# Altium schematic sheet USB_MassProg.SchDoc
size A1
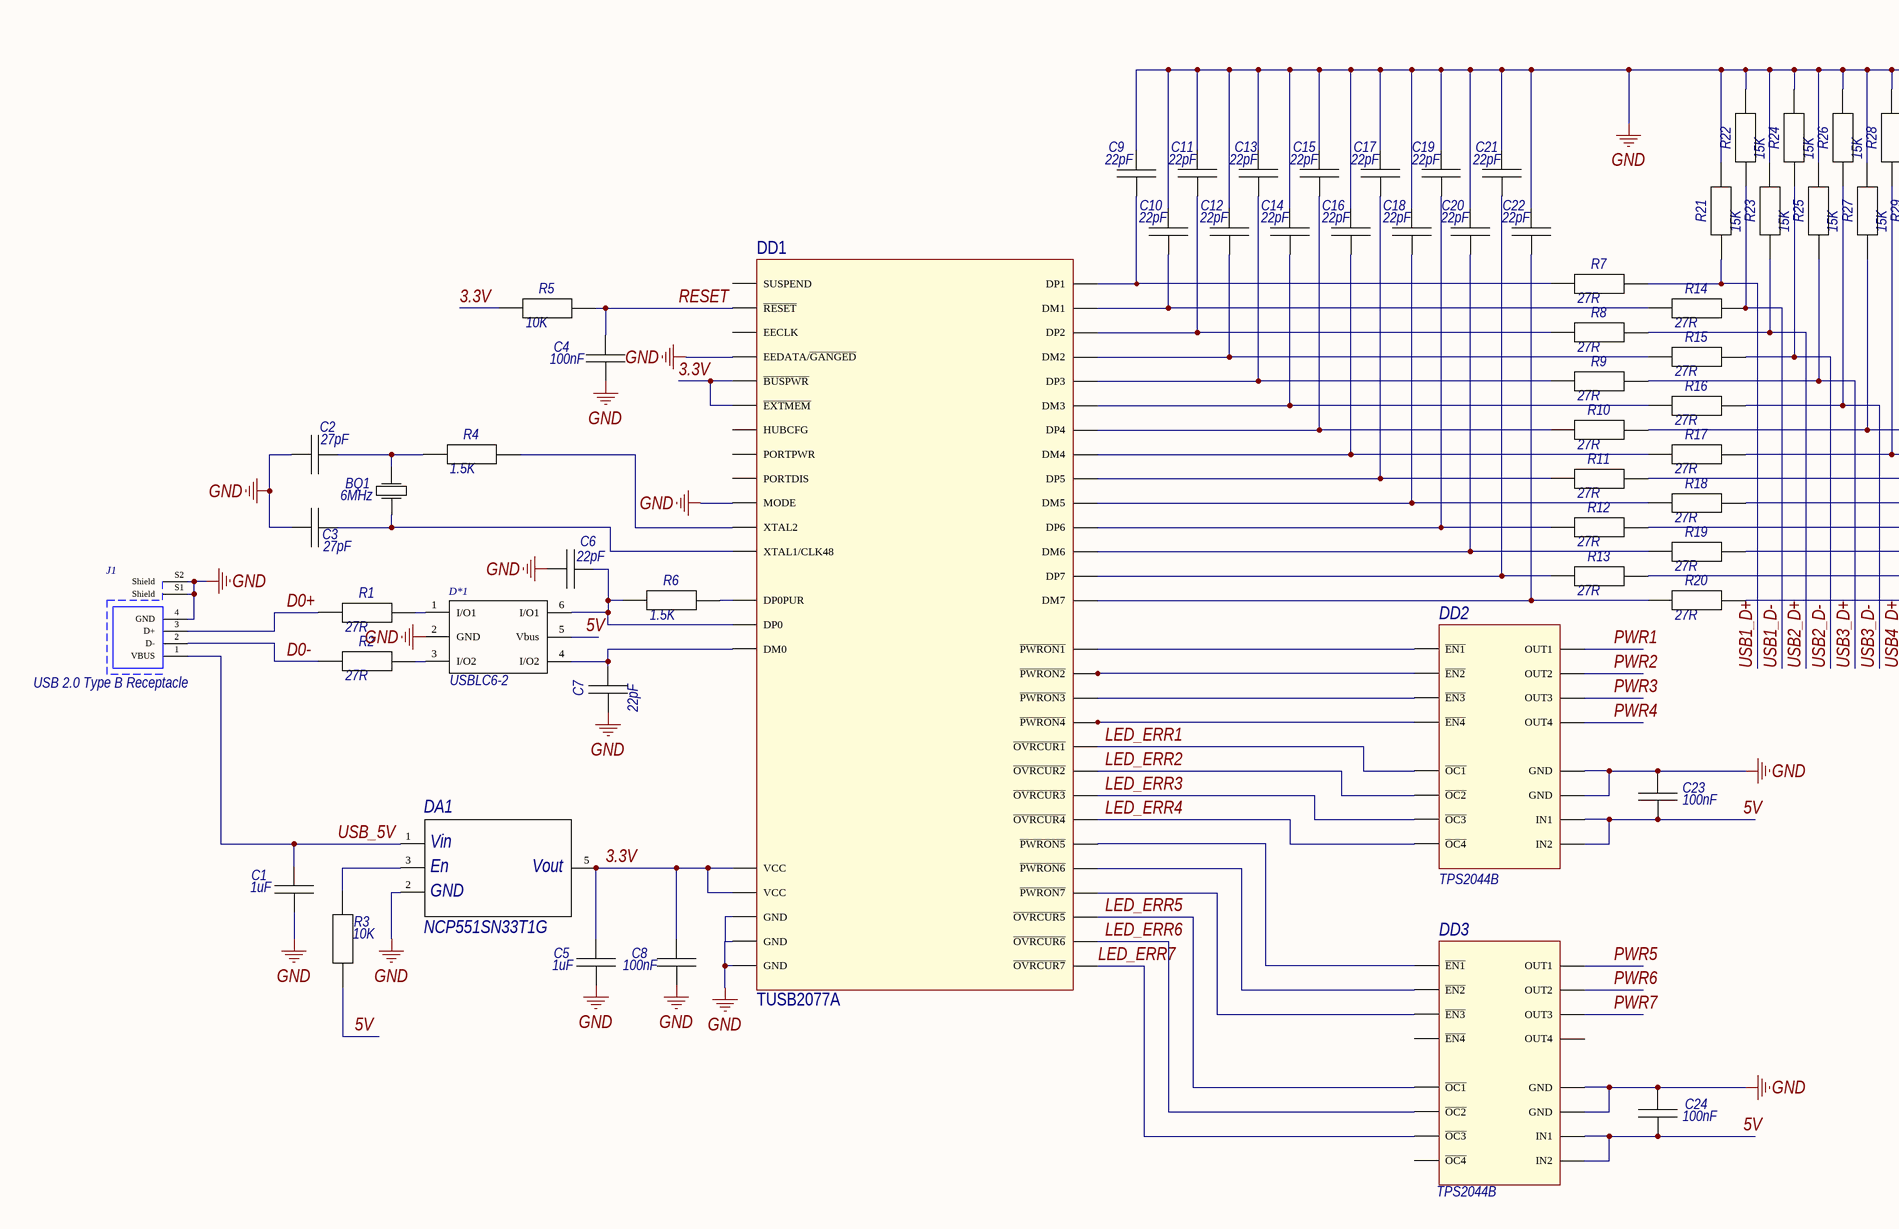
[diagram p0: USB_MassProg.SchDoc, top left]
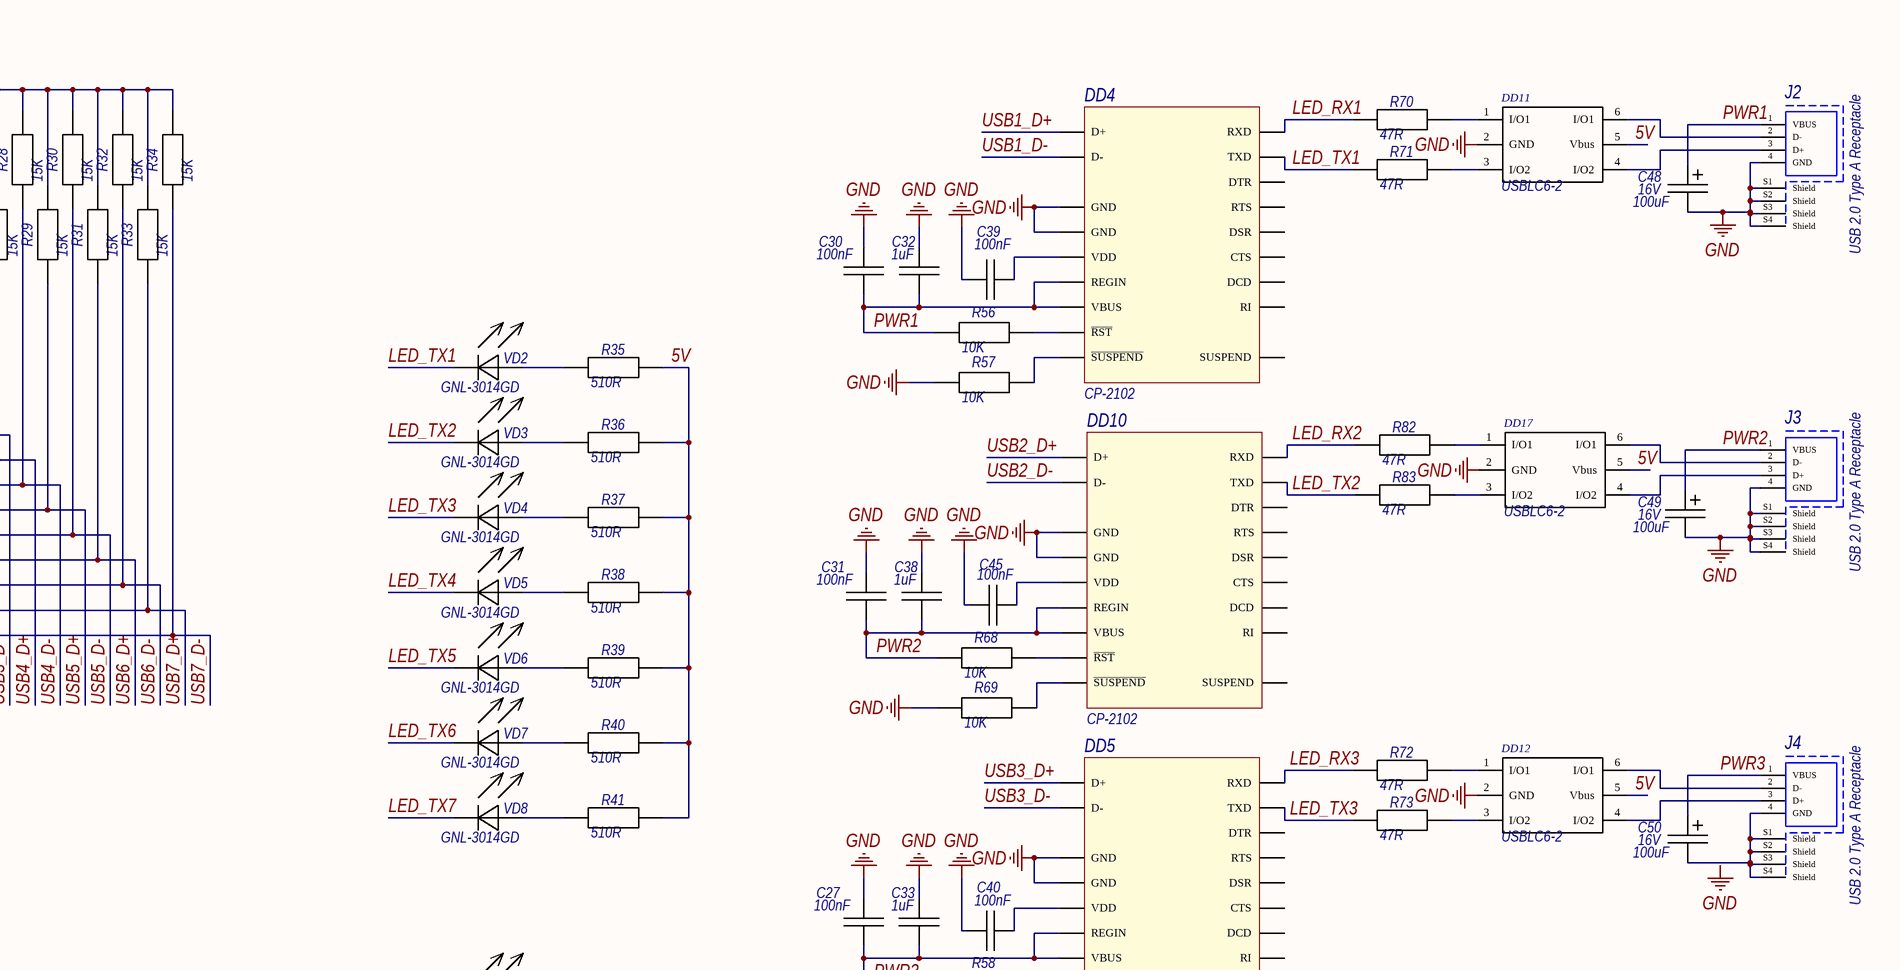
[diagram p1: USB_MassProg.SchDoc, top right]
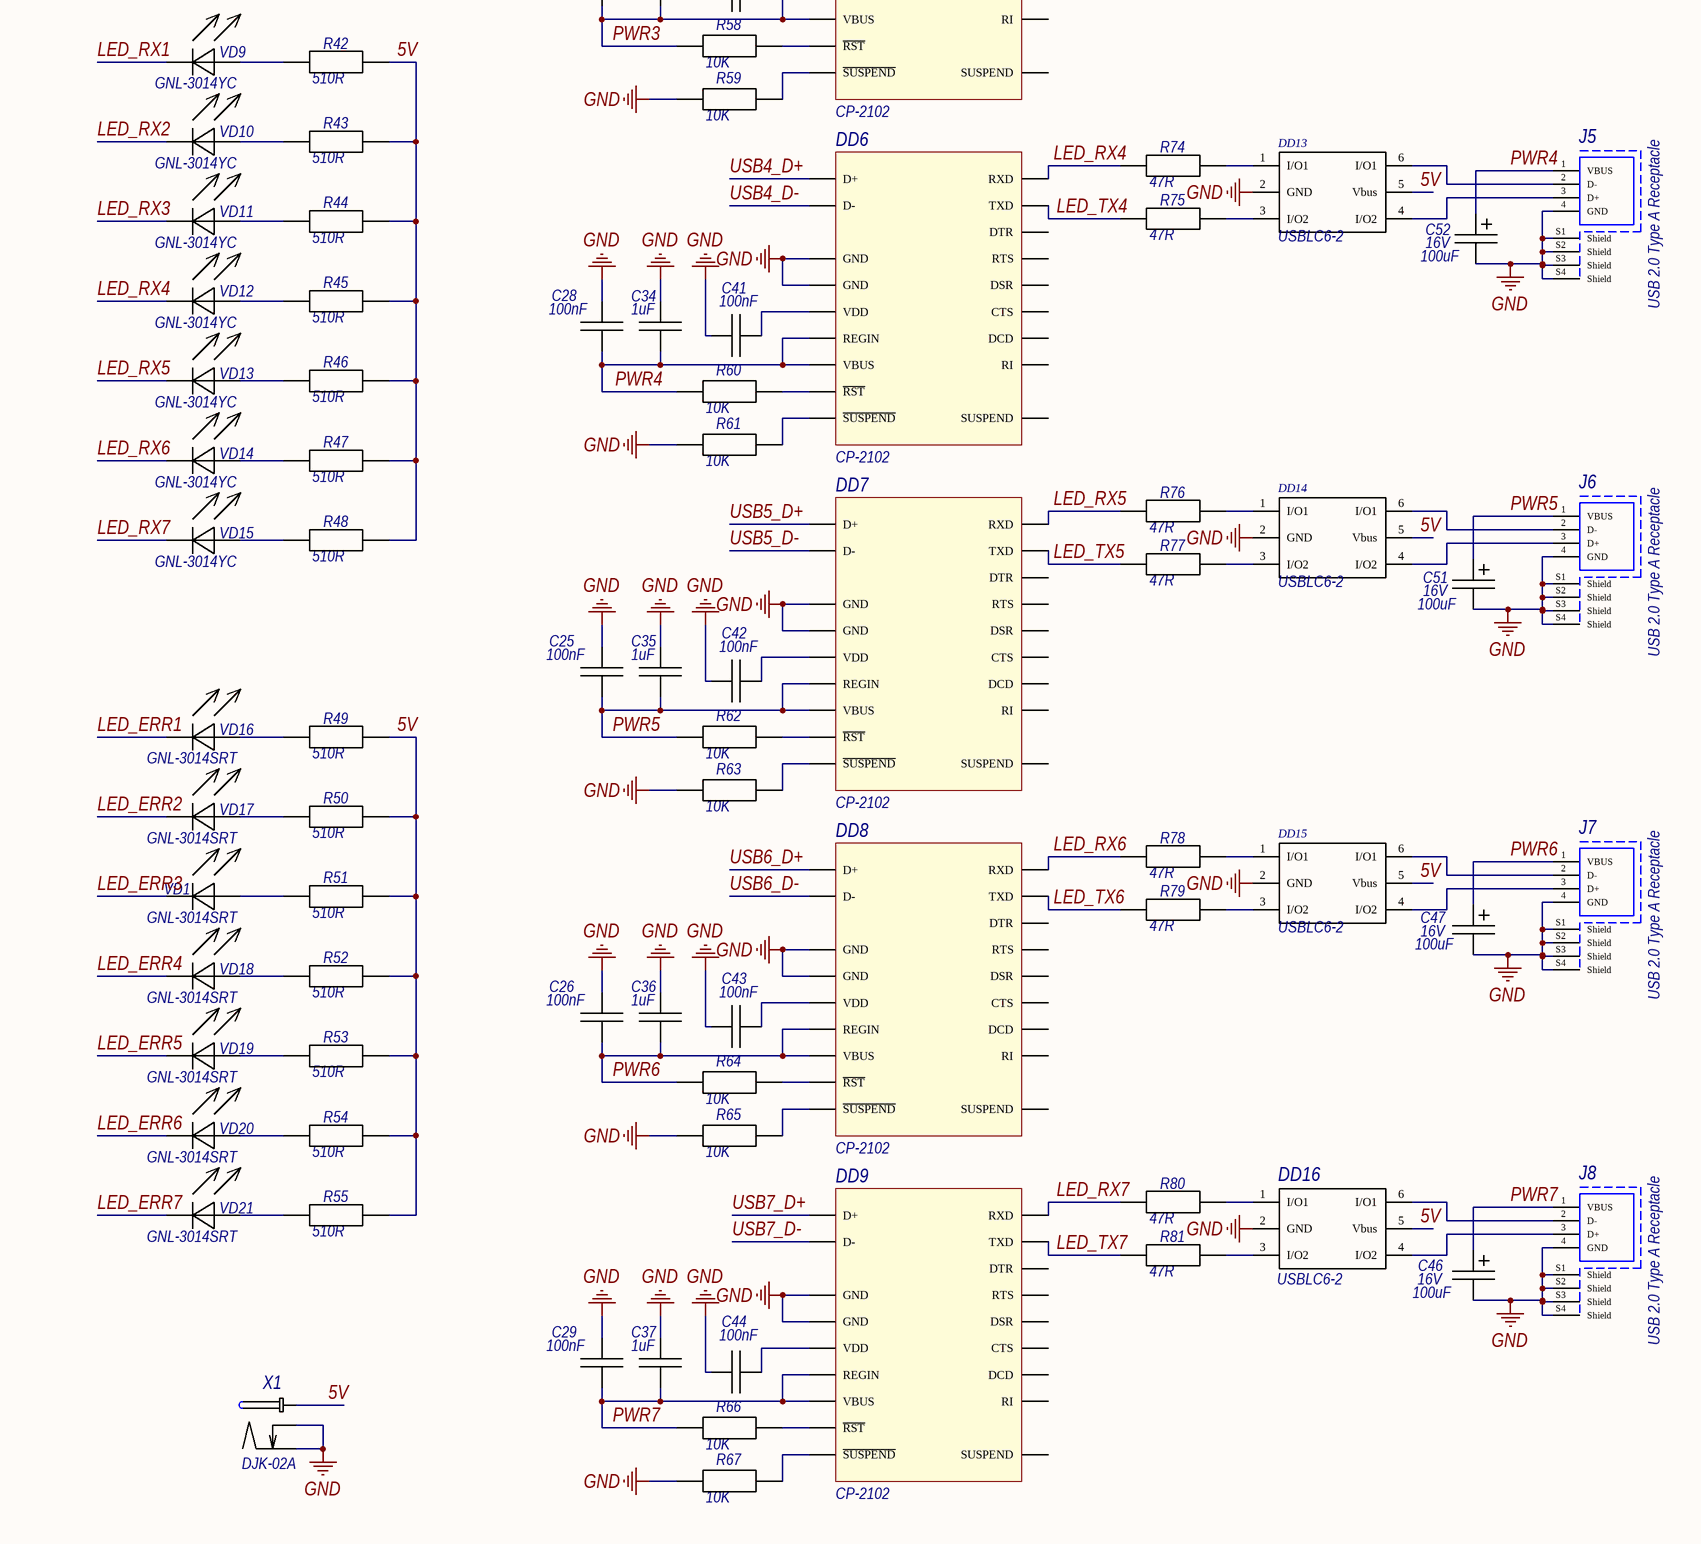
[diagram p2: USB_MassProg.SchDoc, bottom right]

## Parts
BQ1  HC-49SM: 6MHz  [HC-49S]  (hidden comment: HC-49S)
C1  value 1uF  [SMD0603]  (hidden comment: C0603)
C2  value 27pF  [SMD0402]  (hidden comment: C0402)
C3  value 27pF  [SMD0402]  (hidden comment: C0402)
C4  value 100nF  [SMD0402]  (hidden comment: C0402)
C5  value 1uF  [SMD0603]  (hidden comment: C0603)
C6  value 22pF  [SMD0402]  (hidden comment: C0402)
C7  value 22pF  [SMD0402]  (hidden comment: C0402)
C8  value 100nF  [SMD0603]  (hidden comment: C0603)
C9  value 22pF  [SMD0402]  (hidden comment: C0402)
C10  value 22pF  [SMD0402]  (hidden comment: C0402)
C11  value 22pF  [SMD0402]  (hidden comment: C0402)
C12  value 22pF  [SMD0402]  (hidden comment: C0402)
C13  value 22pF  [SMD0402]  (hidden comment: C0402)
C14  value 22pF  [SMD0402]  (hidden comment: C0402)
C15  value 22pF  [SMD0402]  (hidden comment: C0402)
C16  value 22pF  [SMD0402]  (hidden comment: C0402)
C17  value 22pF  [SMD0402]  (hidden comment: C0402)
C18  value 22pF  [SMD0402]  (hidden comment: C0402)
C19  value 22pF  [SMD0402]  (hidden comment: C0402)
C20  value 22pF  [SMD0402]  (hidden comment: C0402)
C21  value 22pF  [SMD0402]  (hidden comment: C0402)
C22  value 22pF  [SMD0402]  (hidden comment: C0402)
C23  value 100nF  [SMD0402]  (hidden comment: C0402)
C24  value 100nF  [SMD0402]  (hidden comment: C0402)
C25  value 100nF  [SMD0402]  (hidden comment: C0402)
C26  value 100nF  [SMD0402]  (hidden comment: C0402)
C27  value 100nF  [SMD0402]  (hidden comment: C0402)
C28  value 100nF  [SMD0402]  (hidden comment: C0402)
C29  value 100nF  [SMD0402]  (hidden comment: C0402)
C30  value 100nF  [SMD0402]  (hidden comment: C0402)
C31  value 100nF  [SMD0402]  (hidden comment: C0402)
C32  value 1uF  [SMD0603]  (hidden comment: C0603)
C33  value 1uF  [SMD0603]  (hidden comment: C0603)
C34  value 1uF  [SMD0603]  (hidden comment: C0603)
C35  value 1uF  [SMD0603]  (hidden comment: C0603)
C36  value 1uF  [SMD0603]  (hidden comment: C0603)
C37  value 1uF  [SMD0603]  (hidden comment: C0603)
C38  value 1uF  [SMD0603]  (hidden comment: C0603)
C39  value 100nF  [SMD0402]  (hidden comment: C0402)
C40  value 100nF  [SMD0402]  (hidden comment: C0402)
C41  value 100nF  [SMD0402]  (hidden comment: C0402)
C42  value 100nF  [SMD0402]  (hidden comment: C0402)
C43  value 100nF  [SMD0402]  (hidden comment: C0402)
C44  value 100nF  [SMD0402]  (hidden comment: C0402)
C45  value 100nF  [SMD0402]  (hidden comment: C0402)
C46  value 100uF  Voltage: 16V  [C_0612]  (hidden comment: C_0612)
C47  value 100uF  Voltage: 16V  [C_0612]  (hidden comment: C_0612)
C48  value 100uF  Voltage: 16V  [C_0612]  (hidden comment: C_0612)
C49  value 100uF  Voltage: 16V  [C_0612]  (hidden comment: C_0612)
C50  value 100uF  Voltage: 16V  [C_0612]  (hidden comment: C_0612)
C51  value 100uF  Voltage: 16V  [C_0612]  (hidden comment: C_0612)
C52  value 100uF  Voltage: 16V  [C_0612]  (hidden comment: C_0612)
D*1  USBLC6-2  [SOT23-6L]
DA1  NCP551SN33T1G  [TSOP-5]
DD1  TUSB2077A  [LQFP-48]
DD2  TPS2044B  [SO16]
DD3  TPS2044B  [SO16]
DD4  CP-2102  [VFQFN-28]
DD5  CP-2102  [VFQFN-28]
DD6  CP-2102  [VFQFN-28]
DD7  CP-2102  [VFQFN-28]
DD8  CP-2102  [VFQFN-28]
DD9  CP-2102  [VFQFN-28]
DD10  CP-2102  [VFQFN-28]
DD11  USBLC6-2  [SOT23-6L]
DD12  USBLC6-2  [SOT23-6L]
DD13  USBLC6-2  [SOT23-6L]
DD14  USBLC6-2  [SOT23-6L]
DD15  USBLC6-2  [SOT23-6L]
DD16  USBLC6-2  [SOT23-6L]
DD17  USBLC6-2  [SOT23-6L]
J1  USB 2.0 Type B Receptacle  [61400416121]
J2  USB 2.0 Type A Receptacle  [614004134726]
J3  USB 2.0 Type A Receptacle  [614004134726]
J4  USB 2.0 Type A Receptacle  [614004134726]
J5  USB 2.0 Type A Receptacle  [614004134726]
J6  USB 2.0 Type A Receptacle  [614004134726]
J7  USB 2.0 Type A Receptacle  [614004134726]
J8  USB 2.0 Type A Receptacle  [614004134726]
R1  value 27R  [SMD0402]  (hidden comment: R0402)
R2  value 27R  [SMD0402]  (hidden comment: R0402)
R3  value 10K  [SMD0402]  (hidden comment: R0402)
R4  value 1.5K  [SMD0402]  (hidden comment: R0402)
R5  value 10K  [SMD0402]  (hidden comment: R0402)
R6  value 1.5K  [SMD0402]  (hidden comment: R0402)
R7  value 27R  [SMD0402]  (hidden comment: R0402)
R8  value 27R  [SMD0402]  (hidden comment: R0402)
R9  value 27R  [SMD0402]  (hidden comment: R0402)
R10  value 27R  [SMD0402]  (hidden comment: R0402)
R11  value 27R  [SMD0402]  (hidden comment: R0402)
R12  value 27R  [SMD0402]  (hidden comment: R0402)
R13  value 27R  [SMD0402]  (hidden comment: R0402)
R14  value 27R  [SMD0402]  (hidden comment: R0402)
R15  value 27R  [SMD0402]  (hidden comment: R0402)
R16  value 27R  [SMD0402]  (hidden comment: R0402)
R17  value 27R  [SMD0402]  (hidden comment: R0402)
R18  value 27R  [SMD0402]  (hidden comment: R0402)
R19  value 27R  [SMD0402]  (hidden comment: R0402)
R20  value 27R  [SMD0402]  (hidden comment: R0402)
R21  value 15K  [SMD0402]  (hidden comment: R0402)
R22  value 15K  [SMD0402]  (hidden comment: R0402)
R23  value 15K  [SMD0402]  (hidden comment: R0402)
R24  value 15K  [SMD0402]  (hidden comment: R0402)
R25  value 15K  [SMD0402]  (hidden comment: R0402)
R26  value 15K  [SMD0402]  (hidden comment: R0402)
R27  value 15K  [SMD0402]  (hidden comment: R0402)
R28  value 15K  [SMD0402]  (hidden comment: R0402)
R29  value 15K  [SMD0402]  (hidden comment: R0402)
R30  value 15K  [SMD0402]  (hidden comment: R0402)
R31  value 15K  [SMD0402]  (hidden comment: R0402)
R32  value 15K  [SMD0402]  (hidden comment: R0402)
R33  value 15K  [SMD0402]  (hidden comment: R0402)
R34  value 15K  [SMD0402]  (hidden comment: R0402)
R35  value 510R  [SMD0603]  (hidden comment: R0603)
R36  value 510R  [SMD0603]  (hidden comment: R0603)
R37  value 510R  [SMD0603]  (hidden comment: R0603)
R38  value 510R  [SMD0603]  (hidden comment: R0603)
R39  value 510R  [SMD0603]  (hidden comment: R0603)
R40  value 510R  [SMD0603]  (hidden comment: R0603)
R41  value 510R  [SMD0603]  (hidden comment: R0603)
R42  value 510R  [SMD0603]  (hidden comment: R0603)
R43  value 510R  [SMD0603]  (hidden comment: R0603)
R44  value 510R  [SMD0603]  (hidden comment: R0603)
R45  value 510R  [SMD0603]  (hidden comment: R0603)
R46  value 510R  [SMD0603]  (hidden comment: R0603)
R47  value 510R  [SMD0603]  (hidden comment: R0603)
R48  value 510R  [SMD0603]  (hidden comment: R0603)
R49  value 510R  [SMD0603]  (hidden comment: R0603)
R50  value 510R  [SMD0603]  (hidden comment: R0603)
R51  value 510R  [SMD0603]  (hidden comment: R0603)
R52  value 510R  [SMD0603]  (hidden comment: R0603)
R53  value 510R  [SMD0603]  (hidden comment: R0603)
R54  value 510R  [SMD0603]  (hidden comment: R0603)
R55  value 510R  [SMD0603]  (hidden comment: R0603)
R56  value 10K  [SMD0402]  (hidden comment: R0402)
R57  value 10K  [SMD0402]  (hidden comment: R0402)
R58  value 10K  [SMD0402]  (hidden comment: R0402)
R59  value 10K  [SMD0402]  (hidden comment: R0402)
R60  value 10K  [SMD0402]  (hidden comment: R0402)
R61  value 10K  [SMD0402]  (hidden comment: R0402)
R62  value 10K  [SMD0402]  (hidden comment: R0402)
R63  value 10K  [SMD0402]  (hidden comment: R0402)
R64  value 10K  [SMD0402]  (hidden comment: R0402)
R65  value 10K  [SMD0402]  (hidden comment: R0402)
R66  value 10K  [SMD0402]  (hidden comment: R0402)
R67  value 10K  [SMD0402]  (hidden comment: R0402)
R68  value 10K  [SMD0402]  (hidden comment: R0402)
R69  value 10K  [SMD0402]  (hidden comment: R0402)
R70  value 47R  [SMD0603]  (hidden comment: R0603)
R71  value 47R  [SMD0603]  (hidden comment: R0603)
R72  value 47R  [SMD0603]  (hidden comment: R0603)
R73  value 47R  [SMD0603]  (hidden comment: R0603)
R74  value 47R  [SMD0603]  (hidden comment: R0603)
R75  value 47R  [SMD0603]  (hidden comment: R0603)
R76  value 47R  [SMD0603]  (hidden comment: R0603)
R77  value 47R  [SMD0603]  (hidden comment: R0603)
R78  value 47R  [SMD0603]  (hidden comment: R0603)
R79  value 47R  [SMD0603]  (hidden comment: R0603)
R80  value 47R  [SMD0603]  (hidden comment: R0603)
R81  value 47R  [SMD0603]  (hidden comment: R0603)
R82  value 47R  [SMD0603]  (hidden comment: R0603)
R83  value 47R  [SMD0603]  (hidden comment: R0603)
VD1  GNL-3014SRT  [LED-5MM (green)]
VD2  GNL-3014GD  [LED-5MM (green)]
VD3  GNL-3014GD  [LED-5MM (green)]
VD4  GNL-3014GD  [LED-5MM (green)]
VD5  GNL-3014GD  [LED-5MM (green)]
VD6  GNL-3014GD  [LED-5MM (green)]
VD7  GNL-3014GD  [LED-5MM (green)]
VD8  GNL-3014GD  [LED-5MM (green)]
VD9  GNL-3014YC  [LED-5MM (green)]
VD10  GNL-3014YC  [LED-5MM (green)]
VD11  GNL-3014YC  [LED-5MM (green)]
VD12  GNL-3014YC  [LED-5MM (green)]
VD13  GNL-3014YC  [LED-5MM (green)]
VD14  GNL-3014YC  [LED-5MM (green)]
VD15  GNL-3014YC  [LED-5MM (green)]
VD16  GNL-3014SRT  [LED-5MM (green)]
VD17  GNL-3014SRT  [LED-5MM (green)]
VD18  GNL-3014SRT  [LED-5MM (green)]
VD19  GNL-3014SRT  [LED-5MM (green)]
VD20  GNL-3014SRT  [LED-5MM (green)]
VD21  GNL-3014SRT  [LED-5MM (green)]
X1  DJK-02A  [DJK-02]

## Nets
GND: C1.1(A) C2.1(A) C3.1(A) C4.1(A) C5.1(A) C6.1(A) C7.1(A) C8.1(A) C9.2(B) C10.2(B) C11.2(B) C12.2(B) C13.2(B) C14.2(B) C15.2(B) C16.2(B) C17.2(B) C18.2(B) C19.2(B) C20.2(B) C21.2(B) C22.2(B) C23.2(B) C24.2(B) C25.2(B) C26.2(B) C27.2(B) C28.2(B) C29.2(B) C30.2(B) C31.2(B) C32.2(B) C33.2(B) C34.2(B) C35.2(B) C36.2(B) C37.2(B) C38.2(B) C39.1(A) C40.1(A) C41.1(A) C42.1(A) C43.1(A) C44.1(A) C45.1(A) C46.2(B) C47.2(B) C48.2(B) C49.2(B) C51.2(B) C52.2(B) D*1.2(GND) DA1.2 DD1.5(GND) DD1.8(EEDATA/~{GANGED}) DD1.24(GND) DD1.43(GND) DD1.48(MODE) DD2.1(GND) DD2.5(GND) DD3.1(GND) DD3.5(GND) DD4.0(GND) DD4.3(GND) DD5.0(GND) DD5.3(GND) DD6.0(GND) DD6.3(GND) DD7.0(GND) DD7.3(GND) DD8.0(GND) DD8.3(GND) DD9.0(GND) DD9.3(GND) DD10.0(GND) DD10.3(GND) DD11.2(GND) DD12.2(GND) DD13.2(GND) DD14.2(GND) DD15.2(GND) DD16.2(GND) DD17.2(GND) J1.4(GND) J1.S1(Shield) J1.S2(Shield) J2.4(GND) J2.S1(Shield) J2.S2(Shield) J2.S3(Shield) J2.S4(Shield) J3.4(GND) J3.S1(Shield) J3.S2(Shield) J3.S3(Shield) J3.S4(Shield) J5.4(GND) J5.S1(Shield) J5.S2(Shield) J5.S3(Shield) J5.S4(Shield) J6.4(GND) J6.S1(Shield) J6.S2(Shield) J6.S3(Shield) J6.S4(Shield) J7.4(GND) J7.S1(Shield) J7.S2(Shield) J7.S3(Shield) J7.S4(Shield) J8.4(GND) J8.S1(Shield) J8.S2(Shield) J8.S3(Shield) J8.S4(Shield) R21.2(B) R22.2(B) R23.2(B) R24.2(B) R25.2(B) R26.2(B) R27.2(B) R28.2(B) R29.2(B) R30.2(B) R31.2(B) R32.2(B) R33.2(B) R34.2(B) R57.1(A) R59.1(A) R61.1(A) R63.1(A) R65.1(A) R67.1(A) R69.1(A) X1.1 X1.2
3.3V: C5.2(B) C8.2(B) DA1.5 DD1.9(VCC) DD1.10(~{BUSPWR}) DD1.46(VCC) DD1.47(~{EXTMEM}) R5.1(A)
5V: C23.1(A) C24.1(A) D*1.5(Vbus) DD2.2(IN1) DD2.6(IN2) DD3.2(IN1) DD3.6(IN2) DD11.5(Vbus) DD12.5(Vbus) DD13.5(Vbus) DD14.5(Vbus) DD15.5(Vbus) DD16.5(Vbus) DD17.5(Vbus) R3.1(A) R35.2(B) R36.2(B) R37.2(B) R38.2(B) R39.2(B) R40.2(B) R41.2(B) R42.2(B) R43.2(B) R44.2(B) R45.2(B) R46.2(B) R47.2(B) R48.2(B) R49.2(B) R50.2(B) R51.2(B) R52.2(B) R53.2(B) R54.2(B) R55.2(B) X1.3
D0+: J1.3(D+) R1.1(A)
D0-: J1.2(D-) R2.1(A)
LED_ERR1: DD1.12(~{OVRCUR1}) DD2.16(~{OC1}) VD16.2(K)
LED_ERR2: DD1.16(~{OVRCUR2}) DD2.13(~{OC2}) VD17.2(K)
LED_ERR3: DD1.20(~{OVRCUR3}) DD2.12(~{OC3}) VD1.2(K)
LED_ERR4: DD1.25(~{OVRCUR4}) DD2.9(~{OC4}) VD18.2(K)
LED_ERR5: DD1.29(~{OVRCUR5}) DD3.16(~{OC1}) VD19.2(K)
LED_ERR6: DD1.33(~{OVRCUR6}) DD3.13(~{OC2}) VD20.2(K)
LED_ERR7: DD1.37(~{OVRCUR7}) DD3.12(~{OC3}) VD21.2(K)
LED_RX1: DD4.25(RXD) R70.1(A) VD9.2(K)
LED_RX2: DD10.25(RXD) R82.1(A) VD10.2(K)
LED_RX3: DD5.25(RXD) R72.1(A) VD11.2(K)
LED_RX4: DD6.25(RXD) R74.1(A) VD12.2(K)
LED_RX5: DD7.25(RXD) R76.1(A) VD13.2(K)
LED_RX6: DD8.25(RXD) R78.1(A) VD14.2(K)
LED_RX7: DD9.25(RXD) R80.1(A) VD15.2(K)
LED_TX1: DD4.26(TXD) R71.1(A) VD2.2(K)
LED_TX2: DD10.26(TXD) R83.1(A) VD3.2(K)
LED_TX3: DD5.26(TXD) R73.1(A) VD4.2(K)
LED_TX4: DD6.26(TXD) R75.1(A) VD5.2(K)
LED_TX5: DD7.26(TXD) R77.1(A) VD6.2(K)
LED_TX6: DD8.26(TXD) R79.1(A) VD7.2(K)
LED_TX7: DD9.26(TXD) R81.1(A) VD8.2(K)
PWR1: C30.1(A) C32.1(A) C48.1(A) DD2.15(OUT1) DD4.7(REGIN) DD4.8(VBUS) J2.1(VBUS) R56.1(A)
PWR2: C31.1(A) C38.1(A) C49.1(A) DD2.14(OUT2) DD10.7(REGIN) DD10.8(VBUS) J3.1(VBUS) R68.1(A)
PWR3: C27.1(A) C33.1(A) C50.1(A) DD2.11(OUT3) DD5.7(REGIN) DD5.8(VBUS) J4.1(VBUS) R58.1(A)
PWR4: C28.1(A) C34.1(A) C52.1(A) DD2.10(OUT4) DD6.7(REGIN) DD6.8(VBUS) J5.1(VBUS) R60.1(A)
PWR5: C25.1(A) C35.1(A) C51.1(A) DD3.15(OUT1) DD7.7(REGIN) DD7.8(VBUS) J6.1(VBUS) R62.1(A)
PWR6: C26.1(A) C36.1(A) C47.1(A) DD3.14(OUT2) DD8.7(REGIN) DD8.8(VBUS) J7.1(VBUS) R64.1(A)
PWR7: C29.1(A) C37.1(A) C46.1(A) DD3.11(OUT3) DD9.7(REGIN) DD9.8(VBUS) J8.1(VBUS) R66.1(A)
RESET: C4.2(B) DD1.6(~{RESET}) R5.2(B)
USB1_D+: DD4.4(D+) R7.2(B) R21.1(A)
USB1_D-: DD4.5(D-) R14.2(B) R22.1(A)
USB2_D+: DD10.4(D+) R8.2(B) R23.1(A)
USB2_D-: DD10.5(D-) R15.2(B) R24.1(A)
USB3_D+: DD5.4(D+) R9.2(B) R25.1(A)
USB3_D-: DD5.5(D-) R16.2(B) R26.1(A)
USB4_D+: DD6.4(D+) R10.2(B) R27.1(A)
USB4_D-: DD6.5(D-) R17.2(B) R28.1(A)
USB5_D+: DD7.4(D+) R11.2(B) R29.1(A)
USB5_D-: DD7.5(D-) R18.2(B) R30.1(A)
USB6_D+: DD8.4(D+) R12.2(B) R31.1(A)
USB6_D-: DD8.5(D-) R19.2(B) R32.1(A)
USB7_D+: DD9.4(D+) R13.2(B) R33.1(A)
USB7_D-: DD9.5(D-) R20.2(B) R34.1(A)
USB_5V: C1.2(B) DA1.1 J1.1(VBUS)
NetBQ1_1: BQ1.1(A0) C3.2(B) DD1.45(XTAL1/CLK48)
NetBQ1_2: BQ1.2(B0) C2.2(B) R4.1(A)
NetC6_2: C6.2(B) D*1.6(I/O1) DD1.3(DP0) R6.1(A)
NetC7_2: C7.2(B) D*1.4(I/O2) DD1.4(DM0)
NetC9_1: C9.1(A) DD1.14(DP1) R7.1(A)
NetC10_1: C10.1(A) DD1.13(DM1) R14.1(A)
NetC11_1: C11.1(A) DD1.18(DP2) R8.1(A)
NetC12_1: C12.1(A) DD1.17(DM2) R15.1(A)
NetC13_1: C13.1(A) DD1.22(DP3) R9.1(A)
NetC14_1: C14.1(A) DD1.21(DM3) R16.1(A)
NetC15_1: C15.1(A) DD1.27(DP4) R10.1(A)
NetC16_1: C16.1(A) DD1.26(DM4) R17.1(A)
NetC17_1: C17.1(A) DD1.31(DP5) R11.1(A)
NetC18_1: C18.1(A) DD1.30(DM5) R18.1(A)
NetC19_1: C19.1(A) DD1.35(DP6) R12.1(A)
NetC20_1: C20.1(A) DD1.34(DM6) R19.1(A)
NetC21_1: C21.1(A) DD1.39(DP7) R13.1(A)
NetC22_1: C22.1(A) DD1.38(DM7) R20.1(A)
NetC39_2: C39.2(B) DD4.6(VDD)
NetC40_2: C40.2(B) DD5.6(VDD)
NetC41_2: C41.2(B) DD6.6(VDD)
NetC42_2: C42.2(B) DD7.6(VDD)
NetC43_2: C43.2(B) DD8.6(VDD)
NetC44_2: C44.2(B) DD9.6(VDD)
NetC45_2: C45.2(B) DD10.6(VDD)
NetC50_2: C50.2(B) J4.4(GND) J4.S1(Shield) J4.S2(Shield) J4.S3(Shield) J4.S4(Shield)
NetD*1_1: D*1.1(I/O1) R1.2(B)
NetD*1_3: D*1.3(I/O2) R2.2(B)
NetDA1_3: DA1.3 R3.2(B)
NetDD1_2: DD1.2(DP0PUR) R6.2(B)
NetDD1_11: DD1.11(~{PWRON1}) DD2.3(~{EN1})
NetDD1_15: DD1.15(~{PWRON2}) DD2.4(~{EN2})
NetDD1_19: DD1.19(~{PWRON3}) DD2.7(~{EN3})
NetDD1_23: DD1.23(~{PWRON4}) DD2.8(~{EN4})
NetDD1_28: DD1.28(~{PWRON5}) DD3.3(~{EN1})
NetDD1_32: DD1.32(~{PWRON6}) DD3.4(~{EN2})
NetDD1_36: DD1.36(~{PWRON7}) DD3.7(~{EN3})
NetDD1_44: DD1.44(XTAL2) R4.2(B)
NetDD4_9: DD4.9(~{RST}) R56.2(B)
NetDD4_10: DD4.10(~{SUSPEND}) R57.2(B)
NetDD5_9: DD5.9(~{RST}) R58.2(B)
NetDD5_10: DD5.10(~{SUSPEND}) R59.2(B)
NetDD6_9: DD6.9(~{RST}) R60.2(B)
NetDD6_10: DD6.10(~{SUSPEND}) R61.2(B)
NetDD7_9: DD7.9(~{RST}) R62.2(B)
NetDD7_10: DD7.10(~{SUSPEND}) R63.2(B)
NetDD8_9: DD8.9(~{RST}) R64.2(B)
NetDD8_10: DD8.10(~{SUSPEND}) R65.2(B)
NetDD9_9: DD9.9(~{RST}) R66.2(B)
NetDD9_10: DD9.10(~{SUSPEND}) R67.2(B)
NetDD10_9: DD10.9(~{RST}) R68.2(B)
NetDD10_10: DD10.10(~{SUSPEND}) R69.2(B)
NetDD11_1: DD11.1(I/O1) R70.2(B)
NetDD11_3: DD11.3(I/O2) R71.2(B)
NetDD11_4: DD11.4(I/O2) J2.3(D+)
NetDD11_6: DD11.6(I/O1) J2.2(D-)
NetDD12_1: DD12.1(I/O1) R72.2(B)
NetDD12_3: DD12.3(I/O2) R73.2(B)
NetDD12_4: DD12.4(I/O2) J4.3(D+)
NetDD12_6: DD12.6(I/O1) J4.2(D-)
NetDD13_1: DD13.1(I/O1) R74.2(B)
NetDD13_3: DD13.3(I/O2) R75.2(B)
NetDD13_4: DD13.4(I/O2) J5.3(D+)
NetDD13_6: DD13.6(I/O1) J5.2(D-)
NetDD14_1: DD14.1(I/O1) R76.2(B)
NetDD14_3: DD14.3(I/O2) R77.2(B)
NetDD14_4: DD14.4(I/O2) J6.3(D+)
NetDD14_6: DD14.6(I/O1) J6.2(D-)
NetDD15_1: DD15.1(I/O1) R78.2(B)
NetDD15_3: DD15.3(I/O2) R79.2(B)
NetDD15_4: DD15.4(I/O2) J7.3(D+)
NetDD15_6: DD15.6(I/O1) J7.2(D-)
NetDD16_1: DD16.1(I/O1) R80.2(B)
NetDD16_3: DD16.3(I/O2) R81.2(B)
NetDD16_4: DD16.4(I/O2) J8.3(D+)
NetDD16_6: DD16.6(I/O1) J8.2(D-)
NetDD17_1: DD17.1(I/O1) R82.2(B)
NetDD17_3: DD17.3(I/O2) R83.2(B)
NetDD17_4: DD17.4(I/O2) J3.3(D+)
NetDD17_6: DD17.6(I/O1) J3.2(D-)
NetR35_1: R35.1(A) VD2.1(A)
NetR36_1: R36.1(A) VD3.1(A)
NetR37_1: R37.1(A) VD4.1(A)
NetR38_1: R38.1(A) VD5.1(A)
NetR39_1: R39.1(A) VD6.1(A)
NetR40_1: R40.1(A) VD7.1(A)
NetR41_1: R41.1(A) VD8.1(A)
NetR42_1: R42.1(A) VD9.1(A)
NetR43_1: R43.1(A) VD10.1(A)
NetR44_1: R44.1(A) VD11.1(A)
NetR45_1: R45.1(A) VD12.1(A)
NetR46_1: R46.1(A) VD13.1(A)
NetR47_1: R47.1(A) VD14.1(A)
NetR48_1: R48.1(A) VD15.1(A)
NetR49_1: R49.1(A) VD16.1(A)
NetR50_1: R50.1(A) VD17.1(A)
NetR51_1: R51.1(A) VD1.1(A)
NetR52_1: R52.1(A) VD18.1(A)
NetR53_1: R53.1(A) VD19.1(A)
NetR54_1: R54.1(A) VD20.1(A)
NetR55_1: R55.1(A) VD21.1(A)

Not connected (* = marked no-connect by the designer): DD1 1(SUSPEND) 7(EECLK) 40(HUBCFG) 41(PORTPWR) 42(PORTDIS); DD3 8(~{EN4}) 9(~{OC4}) 10(OUT4); DD4 1(DCD) 2(RI) 11(SUSPEND) 23(CTS) 24(RTS) 27(DSR) 28(DTR); DD5 1(DCD) 2(RI) 11(SUSPEND) 23(CTS) 24(RTS) 27(DSR) 28(DTR); DD6 1(DCD) 2(RI) 11(SUSPEND) 23(CTS) 24(RTS) 27(DSR) 28(DTR); DD7 1(DCD) 2(RI) 11(SUSPEND) 23(CTS) 24(RTS) 27(DSR) 28(DTR); DD8 1(DCD) 2(RI) 11(SUSPEND) 23(CTS) 24(RTS) 27(DSR) 28(DTR); DD9 1(DCD) 2(RI) 11(SUSPEND) 23(CTS) 24(RTS) 27(DSR) 28(DTR); DD10 1(DCD) 2(RI) 11(SUSPEND) 23(CTS) 24(RTS) 27(DSR) 28(DTR)

## Notes on the sheet
- Labels drawn without touching a wire or pin: GND
- (in symbol NCP551SN33T1G) Vin; En; Vout; GND

## Library data of the parts
C1 C5 C8 C32-C38 = C0603: Prec: {Prec}; Voltage: {Voltage}; Term: {Term}; Pack: {Pack}
C2-C4 C6 C7 C9-C31 C39-C45 = C0402: Prec: {Prec}; Voltage: {Voltage}; Term: {Term}; Pack: {Pack}
C46-C52 = C_0612: Prec: {Prec}; Term: {Term}; Pack: {Pack}
DD1 = TUSB2077A: 7-Port Hub for the Universal Serial Bus
J1 = 61400416121: USB 2.0 Type B, Receptacle, Horizontal, THT; Rated Current: 1.5A; Pin Number: 4; Interface Type: Type B; Working Voltage: 30VAC; ComponentLink1Description: Manufacturer; ComponentLink1URL: http://www.we-online.de; ComponentLink2Description: Datasheet; ComponentLink2URL: https://katalog.we-online.com/em/datasheet/61400416121.pdf; Published Date: September 2019; Publisher: Wurth Elektronik; Part Number: 61400416121; Gender: Receptacle; Type: Horizontal; Packaging: Tray; Operating Temperature: -40 to +105degC; Mounting Technology: THT; Application: USB 2.0
J2-J8 = 614004134726: USB 2.0 Type A, Receptacle, Up Right, THT; Rated Current: 1.5A; Pin Number: 4; Interface Type: Type A; Working Voltage: 30VAC; ComponentLink1Description: Manufacturer; ComponentLink1URL: http://www.we-online.de; ComponentLink2Description: Datasheet; ComponentLink2URL: https://katalog.we-online.com/em/datasheet/614004134726.pdf; Published Date: September 2019; Publisher: Wurth Elektronik; Part Number: 614004134726; Gender: Receptacle; Type: Up Right; Packaging: Tray; Operating Temperature: -40 to +105degC; Mounting Technology: THT; Application: USB 2.0
R1-R34 R56-R69 = R0402: Term: {Term}; Pack: {Pack}; Prec: {Prec}; Power: {Power}
R35-R55 R70-R83 = R0603: Term: {Term}; Pack: {Pack}; Prec: {Prec}; Power: {Power}
VD1-VD21 = L-53SGD: Value: {Value}
X1 = DJK-02A: Value: *